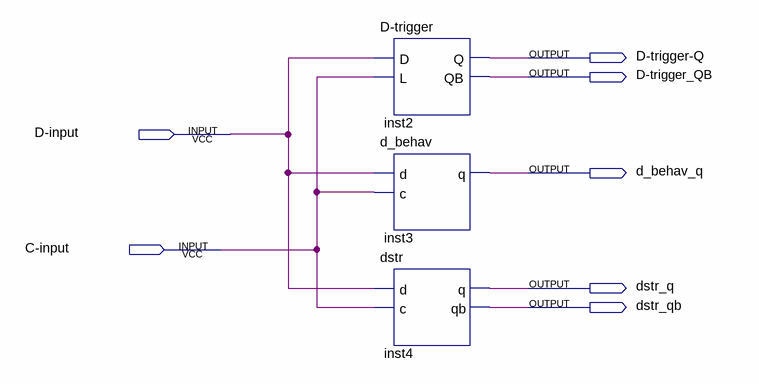
[diagram p0: schematic sheet]
// Quartus schematic D-test.bdf as structural Verilog: 3 symbols, 7 pins
module \D-test  (
  input  \D-input ,
  input  \C-input ,
  output \D-trigger-Q ,
  output \D-trigger_QB ,
  output d_behav_q,
  output dstr_q,
  output dstr_qb
);

  \D-trigger  inst2 (.D(\D-input ), .L(\C-input ), .Q(\D-trigger-Q ), .QB(\D-trigger_QB ));
  d_behav inst3 (.d(\D-input ), .c(\C-input ), .q(d_behav_q));
  dstr inst4 (.d(\D-input ), .c(\C-input ), .q(dstr_q), .qb(dstr_qb));
endmodule
